# Altium schematic sheet MEMS.SchDoc: Gyroscope, Accelerometer, Magnetometer MEMS
size A4; Date: 01-DEC-2013; Author: A.B; CompanyName: STMicroelectronics; Organization: Microcontrollers Division; Address1: 12, Rue Jules HOROWITZ; Address2: 38019 Grenoble; Address3: FRANCE; DocumentNumber: MB1184; Revision: C-01; SheetNumber: 10; SheetTotal: 10; Project: STM32L476G-DISCO
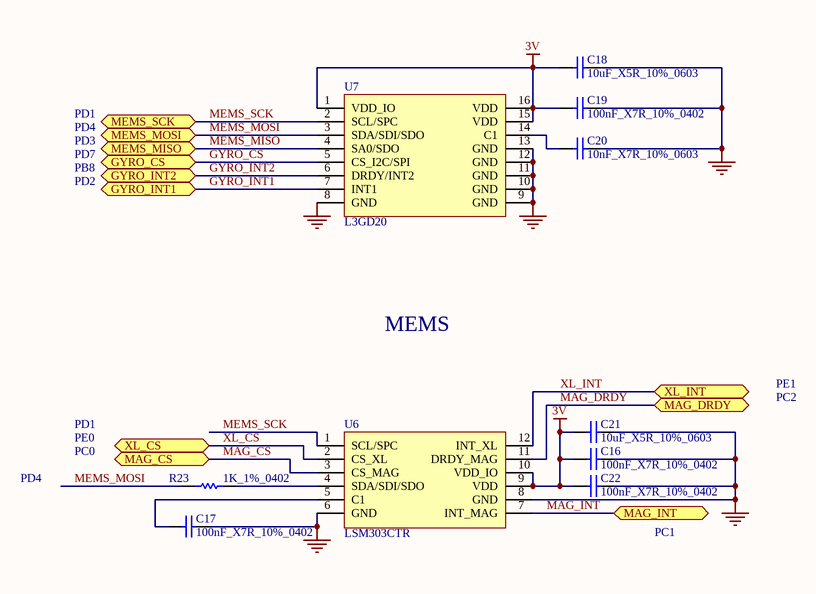
[diagram p0: MEMS.SchDoc]

## Parts
C16  100nF_X7R_10%_0402  [0402C]
C17  100nF_X7R_10%_0402  [0402C]
C18  10uF_X5R_10%_0603  [0603C]
C19  100nF_X7R_10%_0402  [0402C]
C20  10nF_X7R_10%_0603  [0603C]
C21  10uF_X5R_10%_0603  [0603C]
C22  100nF_X7R_10%_0402  [0402C]
R23  1K_1%_0402  [0402R]
U6  LSM303CTR  [LGA12_2x2]
U7  L3GD20  [LGA16-4x4]

## Ports
GYRO_CS, GYRO_INT1, GYRO_INT2, MAG_CS, MAG_DRDY, MAG_INT, MEMS_MISO, MEMS_MOSI, MEMS_SCK, XL_CS, XL_INT

## Nets
3V: C16.1 C18.1 C19.1 C21.1 C22.1 U6.9(VDD) U6.10(VDD_IO) U7.1(VDD_IO) U7.15(VDD) U7.16(VDD)
GND: C16.2 C17.2 C18.2 C19.2 C20.2 C21.2 C22.2 U6.6(GND) U6.8(GND) U7.8(GND) U7.9(GND) U7.10(GND) U7.11(GND) U7.12(GND) U7.13(GND)
GYRO_CS: U7.5(CS_I2C/SPI) ; port GYRO_CS
GYRO_INT1: U7.7(INT1) ; port GYRO_INT1
GYRO_INT2: U7.6(DRDY/INT2) ; port GYRO_INT2
MAG_CS: U6.3(CS_MAG) ; port MAG_CS
MAG_DRDY: U6.11(DRDY_MAG) ; port MAG_DRDY
MAG_INT: U6.7(INT_MAG) ; port MAG_INT
MEMS_MISO: U7.4(SA0/SDO) ; port MEMS_MISO
MEMS_MOSI: R23.1 U7.3(SDA/SDI/SDO) ; port MEMS_MOSI
MEMS_SCK: U6.1(SCL/SPC) U7.2(SCL/SPC) ; port MEMS_SCK
XL_CS: U6.2(CS_XL) ; port XL_CS
XL_INT: U6.12(INT_XL) ; port XL_INT
NetC17_1: C17.1 U6.5(C1)
NetC20_1: C20.1 U7.14(C1)
NetR23_2: R23.2 U6.4(SDA/SDI/SDO)

## Notes on the sheet
- PD7
- PD1
- PD3
- PD4
- PD2
- PB8
- MEMS
- PC2
- PE1
- PC0
- PE0
- PC1
- Title:
- Project:
- Size:
- Date:
- A4
- Reference:
- Sheet:
- Revision:
- of

## Library data of the parts
C16 C17 C19 C22 = Cap_100nF_X7R_10%_0402: Capacitor,100nF,16V,X7R,10%,0402,YAGEO; Manuf_Part_1: CC0402KRX7R7BB104; Revision: July-2002: Re-released for DXP Platform.; Value: 100nF; Order: CC0402KRX7R7BB104; Manuf_1: YAGEO; ECCN_US/EU: n/a
C18 C21 = Cap_10uF_X5R_10%_0603: Capacitor,10uF,6.3V,X5R,10%,0603,YAGEO; Manuf_Part_1: CC0603KRX5R5BB106; Revision: July-2002: Re-released for DXP Platform.; Value: 10uF; Order: CC0603KRX5R5BB106; Manuf_1: YAGEO; ECCN_US/EU: n/a
C20 = Cap_10nF_X7R_10%_0603: Capacitor,10nF,50V,X7R,10%,0603,YAGEO; Manuf_Part_1: CC0603KRX7R9BB103; Revision: July-2002: Re-released for DXP Platform.; Value: 10nF; Order: CC0603KRX7R9BB103; Manuf_1: YAGEO; ECCN_US/EU: n/a
R23 = Res_1K_1%_0402: Resistor,1K,0402,1%,YAGEO; Manuf_Part_1: RC0402FR-071KL; Value: 1K; Manuf_1: YAGEO; Order: RC0402FR-071KL; ECCN_US/EU: n/a
U6 = LSM303CTR: Ultra compact high performance e-compass 3D accelerometer and 3D magnetometer module; Manuf_1: STM; Provided: ST; Ref St: xxxxxxxx; ECCN_US/EU: EAR99/NEC; Manuf_Part_1: LSM303CTR; Distrib: ST; Footprint: LGA12(2*2); Order: LSM303CTR
U7 = L3GD20: MEMS motion sensor three-axis digital output gyroscope, WHO_AM_I REGISTER --> AP3GDL20BCA="11010101", L3GD20="11010100"; Manuf_1: STM; Manuf_Part_1: L3GD20TR; Manuf_Part_2: AP3GDL20BC4; Provided: ST; Ref St: 9177042; ECCN_US/EU: EAR99/NEC; Ref St_2: 9177052; Distrib: ST; Footprint: LGA16(4*4); Order: L3GD20TR; Manuf_2: STM